# Altium schematic sheet 9.RGB&TOUCH.SchDoc
size A4
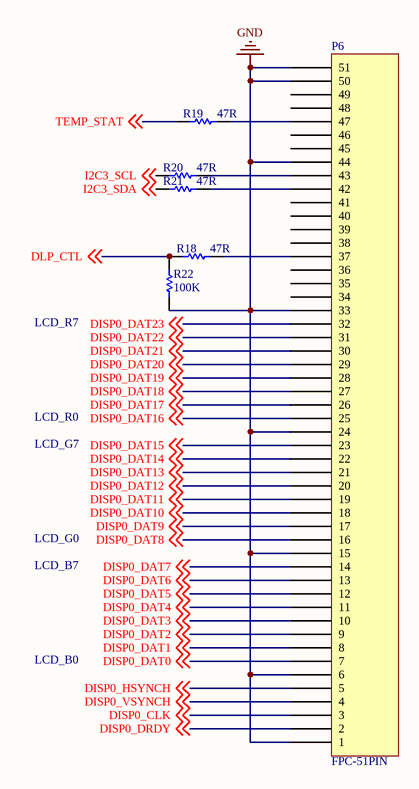
[diagram p0: 9.RGB&TOUCH.SchDoc]

## Parts
P6  FPC-51PIN  [FH26-51S-0.3SHW]
R18  47R  [0603]
R19  47R  [0603]
R20  47R  [0603]
R21  47R  [0603]
R22  100K  [0603]

## Nets
GND: P6.1 P6.6 P6.15 P6.24 P6.33 P6.44 P6.50 P6.51 R22.1
DISP0_CLK: P6.3 ; off-sheet DISP0_CLK
DISP0_DAT0: P6.7 ; off-sheet DISP0_DAT0
DISP0_DAT1: P6.8 ; off-sheet DISP0_DAT1
DISP0_DAT2: P6.9 ; off-sheet DISP0_DAT2
DISP0_DAT3: P6.10 ; off-sheet DISP0_DAT3
DISP0_DAT4: P6.11 ; off-sheet DISP0_DAT4
DISP0_DAT5: P6.12 ; off-sheet DISP0_DAT5
DISP0_DAT6: P6.13 ; off-sheet DISP0_DAT6
DISP0_DAT7: P6.14 ; off-sheet DISP0_DAT7
DISP0_DAT8: P6.16 ; off-sheet DISP0_DAT8
DISP0_DAT9: P6.17 ; off-sheet DISP0_DAT9
DISP0_DAT10: P6.18 ; off-sheet DISP0_DAT10
DISP0_DAT11: P6.19 ; off-sheet DISP0_DAT11
DISP0_DAT12: P6.20 ; off-sheet DISP0_DAT12
DISP0_DAT13: P6.21 ; off-sheet DISP0_DAT13
DISP0_DAT14: P6.22 ; off-sheet DISP0_DAT14
DISP0_DAT15: P6.23 ; off-sheet DISP0_DAT15
DISP0_DAT16: P6.25 ; off-sheet DISP0_DAT16
DISP0_DAT17: P6.26 ; off-sheet DISP0_DAT17
DISP0_DAT18: P6.27 ; off-sheet DISP0_DAT18
DISP0_DAT19: P6.28 ; off-sheet DISP0_DAT19
DISP0_DAT20: P6.29 ; off-sheet DISP0_DAT20
DISP0_DAT21: P6.30 ; off-sheet DISP0_DAT21
DISP0_DAT22: P6.31 ; off-sheet DISP0_DAT22
DISP0_DAT23: P6.32 ; off-sheet DISP0_DAT23
DISP0_DRDY: P6.2 ; off-sheet DISP0_DRDY
DISP0_HSYNCH: P6.5 ; off-sheet DISP0_HSYNCH
DISP0_VSYNCH: P6.4 ; off-sheet DISP0_VSYNCH
DLP_CTL: R18.1 R22.2 ; off-sheet DLP_CTL
I2C3_SCL: R20.1 ; off-sheet I2C3_SCL
I2C3_SDA: R21.1 ; off-sheet I2C3_SDA
TEMP_STAT: R19.1 ; off-sheet TEMP_STAT
NetP6_37: P6.37 R18.2
NetP6_42: P6.42 R21.2
NetP6_43: P6.43 R20.2
NetP6_47: P6.47 R19.2

Not connected (* = marked no-connect by the designer): P6 34 35 36 38 39 40 41 45 46 48 49

## Notes on the sheet
- LCD_R7
- LCD_G7
- LCD_R0
- LCD_B7
- LCD_G0
- LCD_B0

## Library data of the parts
R18-R22 = Res1: Resistor